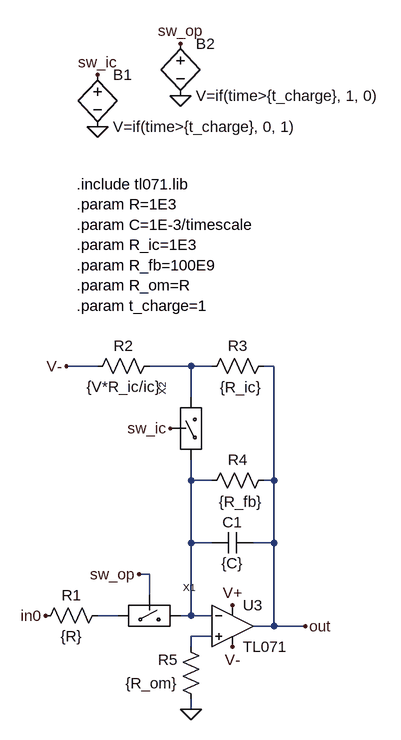
[diagram p0: schematic integrator_true.asc]
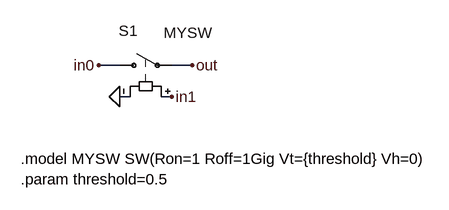
[diagram p1: sub-circuit switch.asc]
integrator_true.asc, the LTspice schematic file:
Version 4
SHEET 1 912 680
WIRE -976 -256 -1024 -256
WIRE -832 -256 -896 -256
WIRE -800 -256 -832 -256
WIRE -704 -256 -720 -256
WIRE -832 -208 -832 -256
WIRE -832 -80 -832 -112
WIRE -800 -80 -832 -80
WIRE -704 -80 -704 -256
WIRE -704 -80 -720 -80
WIRE -832 16 -832 -80
WIRE -800 16 -832 16
WIRE -704 16 -704 -80
WIRE -704 16 -736 16
WIRE -896 64 -912 64
WIRE -896 96 -896 64
WIRE -944 128 -976 128
WIRE -832 128 -832 16
WIRE -832 128 -848 128
WIRE -800 128 -832 128
WIRE -704 144 -704 16
WIRE -704 144 -736 144
WIRE -656 144 -704 144
WIRE -800 160 -832 160
WIRE -832 176 -832 160
WIRE -832 272 -832 256
FLAG -1056 128 in0
FLAG -656 144 out
FLAG -832 272 0
FLAG -1024 -256 V-
FLAG -768 112 V+
FLAG -768 176 V-
FLAG -912 64 sw_op
FLAG -864 -160 sw_ic
FLAG -976 -624 0
FLAG -976 -704 sw_ic
FLAG -848 -672 0
FLAG -848 -752 sw_op
SYMBOL res -960 112 R90
WINDOW 0 0 56 VBottom 2
WINDOW 3 32 56 VTop 2
SYMATTR InstName R1
SYMATTR Value {R}
SYMBOL cap -736 0 R90
WINDOW 0 0 32 VBottom 2
WINDOW 3 32 32 VTop 2
SYMATTR InstName C1
SYMATTR Value {C}
SYMATTR SpiceLine IC=0
SYMBOL res -880 -272 R90
WINDOW 0 0 56 VBottom 2
WINDOW 3 32 56 VTop 2
SYMATTR InstName R2
SYMATTR Value {V*R_ic/ic}
SYMBOL res -704 -272 R90
WINDOW 0 0 56 VBottom 2
WINDOW 3 33 51 VTop 2
SYMATTR InstName R3
SYMATTR Value {R_ic}
SYMBOL opamp2 -768 80 R0
SYMATTR InstName U3
SYMATTR Value TL071
SYMBOL switch -896 128 R0
SYMATTR InstName X1
SYMBOL switch -832 -160 R270
SYMATTR InstName X2
SYMBOL bv -976 -720 R0
SYMATTR InstName B1
SYMATTR Value V=if(time>{t_charge}, 0, 1)
SYMBOL bv -848 -768 R0
SYMATTR InstName B2
SYMATTR Value V=if(time>{t_charge}, 1, 0)
SYMBOL res -704 -96 R90
WINDOW 0 0 56 VBottom 2
WINDOW 3 33 51 VTop 2
SYMATTR InstName R4
SYMATTR Value {R_fb}
SYMBOL res -816 272 R180
WINDOW 0 36 76 Left 2
WINDOW 3 36 40 Left 2
SYMATTR InstName R5
SYMATTR Value {R_om}
TEXT -1008 -536 Left 2 !.include tl071.lib\n.param R=1E3\n.param C=1E-3/timescale\n.param R_ic=1E3\n.param R_fb=100E9\n.param R_om=R\n.param t_charge=1

switch.asc, the sub-circuit schematic file:
Version 4
SHEET 1 880 680
WIRE 192 -112 160 -112
WIRE 304 -112 272 -112
WIRE 208 -64 192 -64
WIRE 272 -64 256 -64
FLAG 160 -112 in0
FLAG 304 -112 out
FLAG 192 -64 0
FLAG 272 -64 in1
SYMBOL sw 176 -112 R270
WINDOW 0 53 15 VRight 2
WINDOW 3 50 84 VRight 2
SYMATTR InstName S1
SYMATTR Value MYSW
TEXT 40 32 Left 2 !.model MYSW SW(Ron=1 Roff=1Gig Vt={threshold} Vh=0)\n.param threshold=0.5

The netlist it stands for:
* integrator_true.asc
R1 N003 in0 {R}
C1 out N002 {C} IC=0
R2 N001 V- {V*R_ic/ic}
R3 out N001 {R_ic}
XU3 N004 N002 V+ V- out TL071  ; pins In+ In- V+ V- OUT
XX1 N003 N002 sw_op switch
XX2 N002 N001 sw_ic switch
B1 sw_ic 0 V=if(time>{t_charge}, 0, 1)
B2 sw_op 0 V=if(time>{t_charge}, 1, 0)
R4 out N002 {R_fb}
R5 0 N004 {R_om}

* block symbol definitions
.subckt switch in0 out in1
S1 in0 out in1 0 MYSW
.model MYSW SW(Ron=1 Roff=1Gig Vt={threshold} Vh=0)
.param threshold=0.5
.ends switch

.include tl071.lib
.param R=1E3
.param C=1E-3/timescale
.param R_ic=1E3
.param R_fb=100E9
.param R_om=R
.param t_charge=1
.backanno
.end